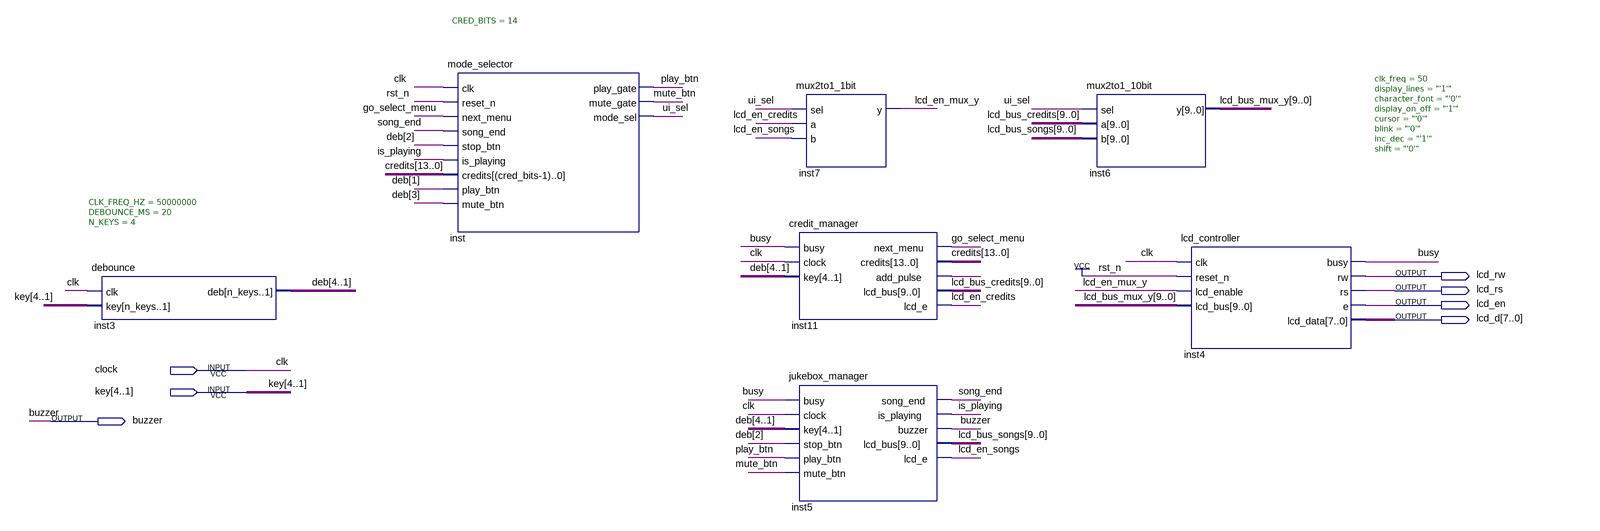
[diagram p0: schematic sheet]
// Quartus schematic jukebox_top.bdf as structural Verilog: 7 symbols, 7 pins
module jukebox_top (
  input  clock,
  input  [4:1] key,
  output lcd_rw,
  output lcd_rs,
  output lcd_en,
  output [7:0] lcd_d,
  output buzzer
);

  wire busy, go_select_menu, inst11_add_pulse, is_playing, lcd_en_credits, lcd_en_mux_y, lcd_en_songs,
       mute_btn, play_btn, song_end, ui_sel;
  wire [4:1] deb;
  wire [9:0] lcd_bus_credits, lcd_bus_mux_y, lcd_bus_songs;
  wire [13:0] credits;

  debounce #(.CLK_FREQ_HZ(50000000), .DEBOUNCE_MS(20), .N_KEYS(4)) inst3 (.clk(clock), .key(key), .deb(deb));
  mode_selector #(.CRED_BITS(14)) inst (
    .clk(clock), .reset_n(1'b1), .next_menu(go_select_menu), .song_end(song_end), .stop_btn(deb[2]),
    .is_playing(is_playing), .credits(credits), .play_btn(deb[1]), .mute_btn(deb[3]), .play_gate(play_btn),
    .mute_gate(mute_btn), .mode_sel(ui_sel));
  credit_manager inst11 (
    .busy(busy), .clock(clock), .key(deb), .next_menu(go_select_menu), .credits(credits),
    .add_pulse(inst11_add_pulse), .lcd_bus(lcd_bus_credits), .lcd_e(lcd_en_credits));
  jukebox_manager inst5 (
    .busy(busy), .clock(clock), .key(deb), .stop_btn(deb[2]), .play_btn(play_btn), .mute_btn(mute_btn),
    .song_end(song_end), .is_playing(is_playing), .buzzer(buzzer), .lcd_bus(lcd_bus_songs),
    .lcd_e(lcd_en_songs));
  mux2to1_1bit inst7 (.sel(ui_sel), .a(lcd_en_credits), .b(lcd_en_songs), .y(lcd_en_mux_y));
  mux2to1_10bit inst6 (.sel(ui_sel), .a(lcd_bus_credits), .b(lcd_bus_songs), .y(lcd_bus_mux_y));
  lcd_controller #(.clk_freq(50), .display_lines("'1'"), .character_font("'0'"), .display_on_off("'1'"), .cursor("'0'"), .blink("'0'"), .inc_dec("'1'"), .shift("'0'")) inst4 (
    .clk(clock), .reset_n(1'b1), .lcd_enable(lcd_en_mux_y), .lcd_bus(lcd_bus_mux_y), .busy(busy),
    .rw(lcd_rw), .rs(lcd_rs), .e(lcd_en), .lcd_data(lcd_d));

  // Other names for the same wires on the sheet: clk = clock
endmodule
